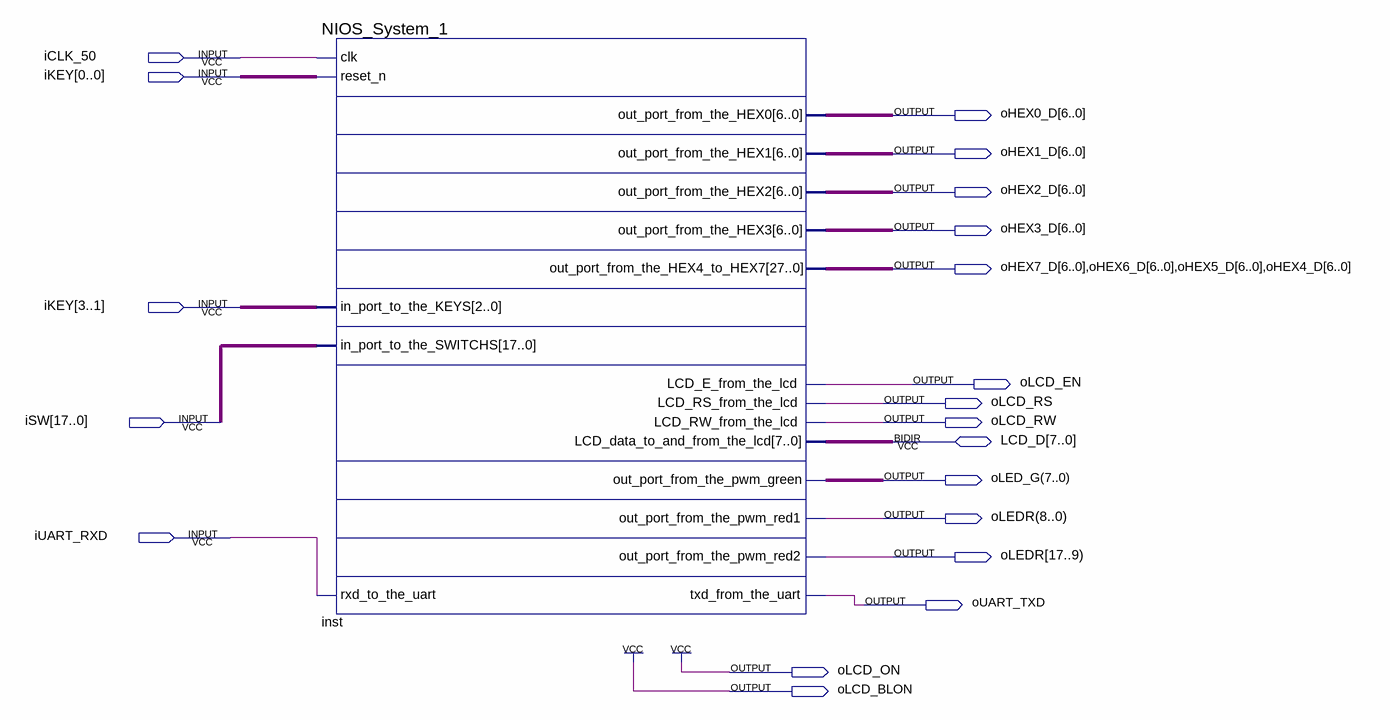
[diagram p0: schematic sheet]
// Quartus schematic Lab_1_SoPC.bdf as structural Verilog: 1 symbols, 20 pins
module Lab_1_SoPC (
  input  iCLK_50,
  input  [3:0] iKEY,
  input  [17:0] iSW,
  input  iUART_RXD,
  inout  [7:0] LCD_D,
  output [6:0] oHEX0_D,
  output [6:0] oHEX1_D,
  output [6:0] oHEX2_D,
  output [6:0] oHEX3_D,
  output [6:0] oHEX7_D,
  output [6:0] oHEX6_D,
  output [6:0] oHEX5_D,
  output [6:0] oHEX4_D,
  output oLCD_EN,
  output oLCD_RS,
  output oLCD_RW,
  output \oLED_G(7..0) ,
  output \oLEDR(8..0) ,
  output \oLEDR[17..9) ,
  output oUART_TXD,
  output oLCD_ON,
  output oLCD_BLON
);

  NIOS_System_1 inst (
    .clk(iCLK_50), .reset_n(iKEY[0]), .in_port_to_the_KEYS(iKEY[3:1]), .in_port_to_the_SWITCHS(iSW),
    .rxd_to_the_uart(iUART_RXD), .out_port_from_the_HEX0(oHEX0_D), .out_port_from_the_HEX1(oHEX1_D),
    .out_port_from_the_HEX2(oHEX2_D), .out_port_from_the_HEX3(oHEX3_D),
    .out_port_from_the_HEX4_to_HEX7({oHEX7_D, oHEX6_D, oHEX5_D, oHEX4_D}), .LCD_E_from_the_lcd(oLCD_EN),
    .LCD_RS_from_the_lcd(oLCD_RS), .LCD_RW_from_the_lcd(oLCD_RW),
    .out_port_from_the_pwm_green(\oLED_G(7..0) ), .out_port_from_the_pwm_red1(\oLEDR(8..0) ),
    .out_port_from_the_pwm_red2(\oLEDR[17..9) ), .txd_from_the_uart(oUART_TXD),
    .LCD_data_to_and_from_the_lcd(LCD_D));

  assign oLCD_BLON = 1'b1;
  assign oLCD_ON = 1'b1;
endmodule
